# EAGLE design uno-test-shield (EAGLE 7.7.0)
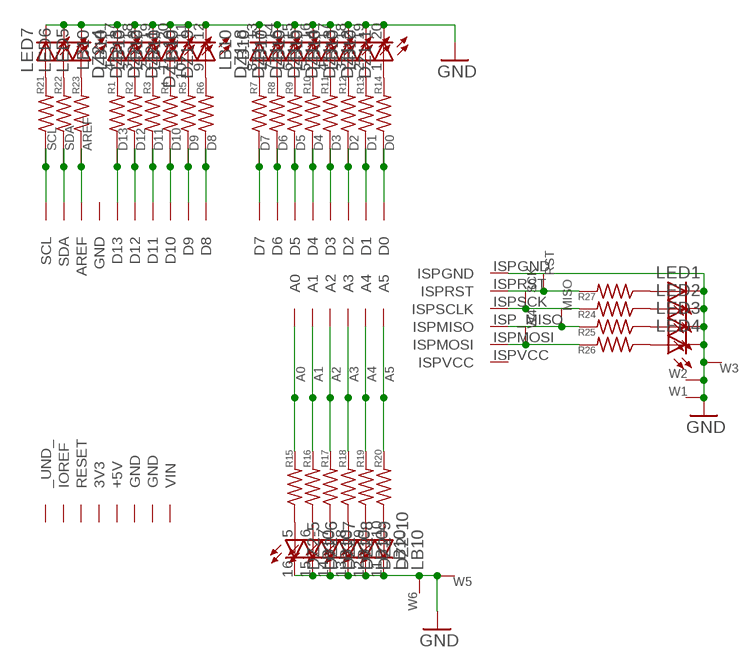
[diagram p0: schematic, sheet 1]

## Parts
A0  WIRE-VIA11  [VIA11]
A1  WIRE-VIA11  [VIA11]
A2  WIRE-VIA11  [VIA11]
A3  WIRE-VIA11  [VIA11]
A4  WIRE-VIA11  [VIA11]
A5  WIRE-VIA11  [VIA11]
AREF  WIRE-VIA11  [VIA11]
D0  WIRE-VIA11  [VIA11]
D1  WIRE-VIA11  [VIA11]
D2  WIRE-VIA11  [VIA11]
D3  WIRE-VIA11  [VIA11]
D4  WIRE-VIA11  [VIA11]
D5  WIRE-VIA11  [VIA11]
D6  WIRE-VIA11  [VIA11]
D7  WIRE-VIA11  [VIA11]
D8  WIRE-VIA11  [VIA11]
D9  WIRE-VIA11  [VIA11]
D10  WIRE-VIA11  [VIA11]
D11  WIRE-VIA11  [VIA11]
D12  WIRE-VIA11  [VIA11]
D13  WIRE-VIA11  [VIA11]
DZ1  LB10  [LB10]
DZ2  LB10  [LB10]
LED1  LED3MM  [LED3MM]
LED2  LED3MM  [LED3MM]
LED3  LED3MM  [LED3MM]
LED4  LED3MM  [LED3MM]
LED5  LED3MM  [LED3MM]
LED6  LED3MM  [LED3MM]
LED7  LED3MM  [LED3MM]
MISO  WIRE-VIA11  [VIA11]
R1  R-US_R0805  [R0805]
R2  R-US_R0805  [R0805]
R3  R-US_R0805  [R0805]
R4  R-US_R0805  [R0805]
R5  R-US_R0805  [R0805]
R6  R-US_R0805  [R0805]
R7  R-US_R0805  [R0805]
R8  R-US_R0805  [R0805]
R9  R-US_R0805  [R0805]
R10  R-US_R0805  [R0805]
R11  R-US_R0805  [R0805]
R12  R-US_R0805  [R0805]
R13  R-US_R0805  [R0805]
R14  R-US_R0805  [R0805]
R15  R-US_R0805  [R0805]
R16  R-US_R0805  [R0805]
R17  R-US_R0805  [R0805]
R18  R-US_R0805  [R0805]
R19  R-US_R0805  [R0805]
R20  R-US_R0805  [R0805]
R21  R-US_R0805  [R0805]
R22  R-US_R0805  [R0805]
R23  R-US_R0805  [R0805]
R24  R-US_R0805  [R0805]
R25  R-US_R0805  [R0805]
R26  R-US_R0805  [R0805]
R27  R-US_R0805  [R0805]
RST  WIRE-VIA11  [VIA11]
SCK  WIRE-VIA11  [VIA11]
SCL  WIRE-VIA11  [VIA11]
SDA  WIRE-VIA11  [VIA11]
U$1  ARDUINO-R3ALLNOHOLES  [R3+ISP-NOHOLES]
W1  WIRE-VIA11  [VIA11]
W2  WIRE-VIA11  [VIA11]
W3  WIRE-VIA11  [VIA11]
W4  WIRE-VIA11  [VIA11]
W5  WIRE-VIA11  [VIA11]
W6  WIRE-VIA11  [VIA11]

## Nets
AREF: AREF.P$1 R23.1 U$1.DAREF(AREF)
D0: D0.P$1 R14.1 U$1.D0
GND [power]: DZ1.11(-10:C) DZ1.12(-9:C) DZ1.13(-8:C) DZ1.14(-7:C) DZ1.15(-6:C) DZ1.16(-5:C) DZ1.17(-4:C) DZ1.18(-3:C) DZ1.19(-2:C) DZ1.20(-1:C) DZ2.11(-10:C) DZ2.12(-9:C) DZ2.13(-8:C) DZ2.14(-7:C) DZ2.15(-6:C) DZ2.16(-5:C) DZ2.17(-4:C) DZ2.18(-3:C) DZ2.19(-2:C) DZ2.20(-1:C) LED1.K(C) LED2.K(C) LED3.K(C) LED4.K(C) LED5.K(C) LED6.K(C) LED7.K(C) U$1.ISPGND W1.P$1 W2.P$1 W3.P$1 W5.P$1 W6.P$1
MISO: MISO.P$1 R25.2 U$1.ISP_MISO(ISPMISO)
MOSI: R26.2 U$1.ISPMOSI W4.P$1
N$1: D13.P$1 R1.1 U$1.D13
N$2: DZ2.4(-4:A) R1.2
N$3: D12.P$1 R2.1 U$1.D12
N$4: DZ2.3(-3:A) R2.2
N$5: D11.P$1 R3.1 U$1.D11
N$6: DZ2.2(-2:A) R3.2
N$7: D10.P$1 R4.1 U$1.D10
N$8: DZ2.1(-1:A) R4.2
N$9: D9.P$1 R5.1 U$1.D9
N$10: DZ1.10(-10:A) R5.2
N$11: D8.P$1 R6.1 U$1.D8
N$12: DZ1.9(-9:A) R6.2
N$13: D7.P$1 R7.1 U$1.D7
N$14: DZ1.8(-8:A) R7.2
N$15: D6.P$1 R8.1 U$1.D6
N$16: DZ1.7(-7:A) R8.2
N$17: D5.P$1 R9.1 U$1.D5
N$18: DZ1.6(-6:A) R9.2
N$19: D4.P$1 R10.1 U$1.D4
N$20: DZ1.5(-5:A) R10.2
N$21: D3.P$1 R11.1 U$1.D3
N$22: DZ1.4(-4:A) R11.2
N$23: D2.P$1 R12.1 U$1.D2
N$24: DZ1.3(-3:A) R12.2
N$25: D1.P$1 R13.1 U$1.D1
N$26: DZ1.2(-2:A) R13.2
N$28: DZ1.1(-1:A) R14.2
N$29: A0.P$1 R15.2 U$1.A0
N$30: DZ2.5(-5:A) R15.1
N$31: A1.P$1 R16.2 U$1.A1
N$32: DZ2.6(-6:A) R16.1
N$33: A2.P$1 R17.2 U$1.A2
N$34: DZ2.7(-7:A) R17.1
N$35: A3.P$1 R18.2 U$1.A3
N$36: DZ2.8(-8:A) R18.1
N$37: A4.P$1 R19.2 U$1.A4
N$38: DZ2.9(-9:A) R19.1
N$39: A5.P$1 R20.2 U$1.A5
N$40: DZ2.10(-10:A) R20.1
N$48: LED1.A R27.1
N$49: LED2.A R24.1
N$50: LED3.A R25.1
N$51: LED4.A R26.1
N$52: LED5.A R23.2
N$53: LED6.A R22.2
N$54: LED7.A R21.2
RST: R27.2 RST.P$1 U$1.ISPRST
SCK: R24.2 SCK.P$1 U$1.ISPSCK(ISPSCLK)
SCL: R21.1 SCL.P$1 U$1.DSCL(SCL)
SDA: R22.1 SDA.P$1 U$1.DSDA(SDA)
Unconnected: U$1.PWR_IOREF(IOREF) U$1.PWR_RST(RESET) U$1.PWR_UNUSED(_UND_)

## Power pins joined to a net without a drawn wire
3V3: U$1.PWR+3V(3V3)
+5V: U$1.PWR+5(+5V)
GND: U$1.DGND(GND) U$1.PWRGND1(GND) U$1.PWRGND2(GND)
ISPVCC: U$1.ISPVCC
VIN: U$1.PWRVIN(VIN)

## Library data of the parts
A0 A1-A5 AREF D0 D1-D13 MISO RST SCK SCL SDA W1-W6 = mylib4:WIRE: Pad for a wire offboard
DZ1 DZ2 = led:LB10: LED BLOCK 10-LED bar graph, DIL, Siemens
LED1-LED7 = my-led:LED: LED OSRAM: - CHIPLED LG R971, LG N971, LY N971, LG Q971, LY Q971, LO R971, LY R971 LH N974, LH R974 LS Q976, LO Q976, LY Q976 LO Q996 - Hyper CHIPLED LW Q18S LB Q993, LB Q99A, LB R99A - SideLED LS A670, LO A670, LY A670, LG A670, LP A670 LB A673, LV A673, LT A673, LW A673 LH A674 LY A675 LS A676, LA A676, LO A676, LY A676, LW A676 LS A679, LY A679, LG A679 - Hyper Micro SIDELED® LS Y876, LA Y876, LO Y876, LY Y876 LT Y87S - SmartLED LW L88C, LW L88S LB L89C, LB L89S, LG L890 LS L89K, LO L89K, LY L89K LS L896, LA L896, LO L896, LY L896 - TOPLED LS T670, LO T670, LY T670, LG T670, LP T670 LSG T670, LSP T670, LSY T670, LOP T670, LYG T670 LG T671, LOG T671, LSG T671 LB T673, LV T673, LT T673, LW T673 LH T674 LS T676, LA T676, LO T676, LY T676, LB T676, LH T676, LSB T676, LW T676 LB T67C, LV T67C, LT T67C, LS T67K, LO T67K, LY T67K, LW E67C LS E67B, LA E67B, LO E67B, LY E67B, LB E67C, LV E67C, LT E67C LW T67C LS T679, LY T679, LG T679 LS T770, LO T770, LY T770, LG T770, LP T770 LB T773, LV T773, LT T773, LW T773 LH T774 LS E675, LA E675, LY E675, LS T675 LS T776, LA T776, LO T776, LY T776, LB T776 LHGB T686 LT T68C, LB T68C - Hyper Mini TOPLED® LB M676 - Mini TOPLED Santana® LG M470 LS M47K, LO M47K, LY M47K Source: http://www.osram.convergy.de/
R1-R27 = my-rcl:R-US_: RESISTOR, American symbol
U$1 = Arduino-shield-scaffolds:ARDUINO-R3ALL

## Net classes
0 default: width 0.5 mm
1 power: width 0.8 mm

## Board
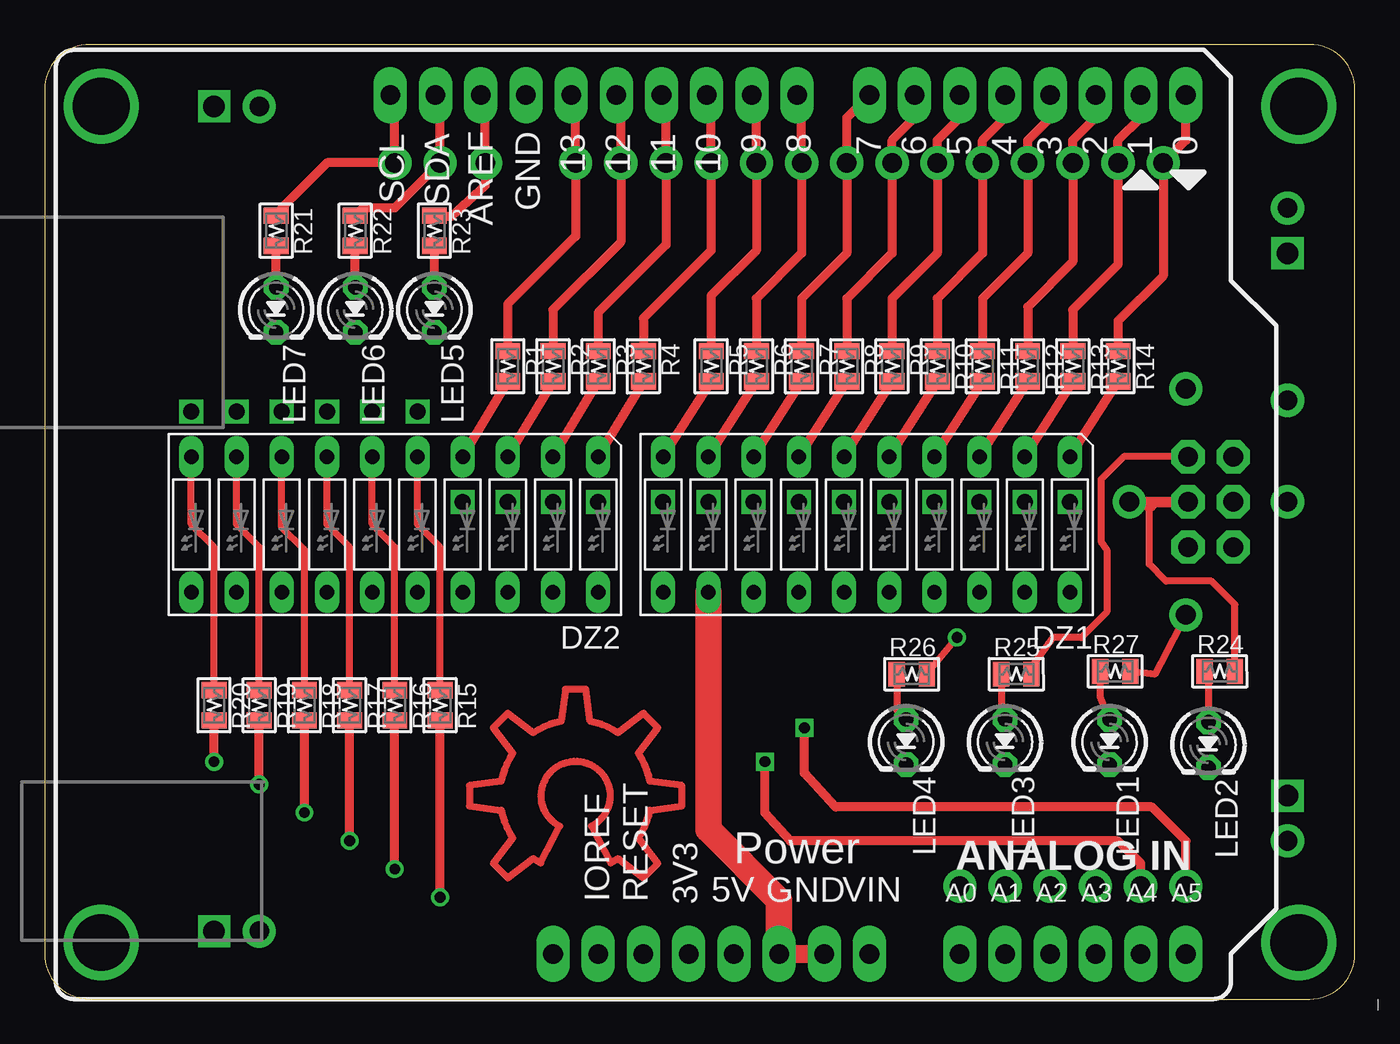
[diagram p1: board, top side]
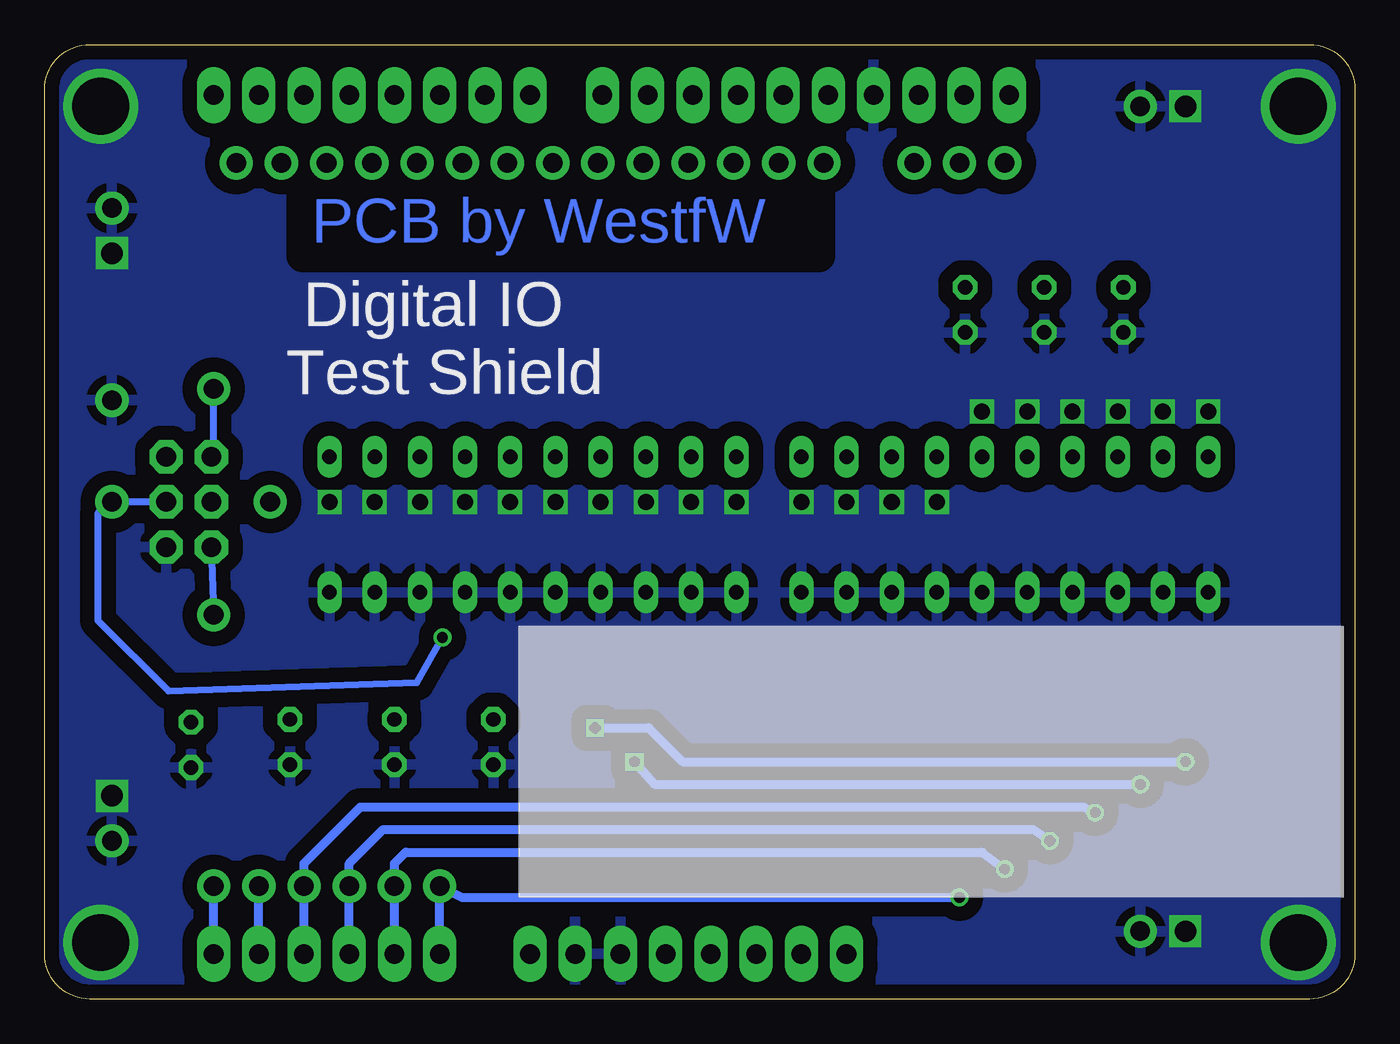
[diagram p2: board, bottom side, seen from below]

Size 73.64 x 53.65 mm. Coordinates in mm from the lower left corner, seen from the top.
Outline: 0,51.1 0,2.54 arc90 2.54,0 71.1,0 arc90 73.64,2.54 73.64,51.1 arc90 71.1,53.65 2.54,53.65 arc90 0,51.1
Copper layers (1*16): Top 0.035mm / dielectric 1.5mm / Bottom 0.035mm
Design rules "default *": minimum track width 10mil, minimum drill 24mil, track to track 8mil, track to pad 8mil, pad to pad 8mil, via to via 8mil, smd to smd 8mil, copper to edge 20mil, drill to drill 8mil, minimum pad ring 10mil, minimum via ring 8mil, stop-mask expansion 4mil, vias tented up to drill 0mil, thermal gap 20mil
bRestrict: 3 lines

### Footprints (pad centres in the part's own frame; a part is rotated, then mirrored left to right if it is on the bottom)
VIA11 = drill 1.1: P$1 0,0
LB10 = drill 0.813 long: 1 -11.43,-3.81; 2 -8.89,-3.81; 3 -6.35,-3.81; 4 -3.81,-3.81; 5 -1.27,-3.81; 6 1.27,-3.81; 7 3.81,-3.81; 8 6.35,-3.81; 9 8.89,-3.81; 10 11.43,-3.81; 11 11.43,3.81; 12 8.89,3.81; 13 6.35,3.81; 14 3.81,3.81; 15 1.27,3.81; 16 -1.27,3.81; 17 -3.81,3.81; 18 -6.35,3.81; 19 -8.89,3.81; 20 -11.43,3.81
LED3MM = drill 0.813 octagon: A -1.27,0; K 1.27,0
R0805 = smd 0.914 x 1.397: 1 -0.85,0; 2 0.85,0
R3+ISP-NOHOLES = drill 1.1 long: A0 50.8,2.54; A1 53.34,2.54; A2 55.88,2.54; A3 58.42,2.54; A4 60.96,2.54; A5 63.5,2.54; D0 63.5,50.8; D1 60.96,50.8; D2 58.42,50.8; D3 55.88,50.8; D4 53.34,50.8; D5 50.8,50.8; D6 48.26,50.8; D7 45.72,50.8; D8 41.656,50.8; D9 39.116,50.8; D10 36.576,50.8; D11 34.036,50.8; D12 31.496,50.8; D13 28.956,50.8; DAREF 23.876,50.8; DGND 26.416,50.8; DSCL 18.796,50.8; DSDA 21.336,50.8; PWR+3V 35.56,2.54; PWR+5 38.1,2.54; PWR_IOREF 30.48,2.54; PWR_RST 33.02,2.54; PWR_UNUSED 27.94,2.54; PWRGND1 40.64,2.54; PWRGND2 43.18,2.54; PWRVIN 45.72,2.54 | drill 1.1 octagon: ISP_MISO 63.627,30.48; ISPGND 66.167,25.4; ISPMOSI 66.167,27.94; ISPRST 63.627,25.4; ISPSCK 63.627,27.94; ISPVCC 66.167,30.48

### Placement (x,y rotation side)
A0  51.43,6.35 0 top
A1  53.98,6.35 0 top
A2  56.52,6.35 0 top
A3  59.05,6.35 0 top
A4  61.59,6.35 0 top
A5  64.14,6.35 0 top
AREF  24.77,46.99 0 top
D0  62.86,46.99 0 top
D1  60.32,46.99 0 top
D2  57.78,46.99 0 top
D3  55.24,46.99 0 top
D4  52.7,46.99 0 top
D5  50.16,46.99 0 top
D6  47.62,46.99 0 top
D7  45.09,46.99 0 top
D8  42.55,46.99 0 top
D9  40,46.99 0 top
D10  37.46,46.99 0 top
D11  34.92,46.99 0 top
D12  32.38,46.99 0 top
D13  29.84,46.99 0 top
DZ1  46.2,26.67 180 top
DZ2  19.69,26.67 180 top
LED1  59.85,14.45 270 top
LED2  65.41,14.29 270 top
LED3  53.98,14.45 270 top
LED4  48.42,14.45 270 top
LED5  21.91,38.73 270 top
LED6  17.46,38.73 270 top
LED7  13.02,38.73 270 top
MISO  64.14,34.29 0 top
R1  26.03,35.56 270 top
R2  28.58,35.56 270 top
R3  31.12,35.56 270 top
R4  33.66,35.56 270 top
R5  37.46,35.56 270 top
R6  40,35.56 270 top
R7  42.55,35.56 270 top
R8  45.09,35.56 270 top
R9  47.62,35.56 270 top
R10  50.16,35.56 270 top
R11  52.7,35.56 270 top
R12  55.24,35.56 270 top
R13  57.78,35.56 270 top
R14  60.32,35.56 270 top
R15  22.23,16.51 270 top
R16  19.69,16.51 270 top
R17  17.14,16.51 270 top
R18  14.61,16.51 270 top
R19  12.07,16.51 270 top
R20  9.53,16.51 270 top
R21  13.02,43.18 270 top
R22  17.46,43.18 270 top
R23  21.91,43.18 270 top
R24  66.04,18.41 0 top
R25  54.61,18.26 0 top
R26  48.74,18.26 0 top
R27  60.17,18.41 0 top
RST  64.14,21.59 0 top
SCK  60.96,27.94 0 top
SCL  19.69,46.99 0 top
SDA  22.23,46.99 0 top
U$1  0.63,0 0 top
W1  12.07,3.81 0 top
W2  12.07,50.16 0 top
W3  69.85,44.45 0 top
W4  69.85,27.94 0 top
W5  69.85,33.66 0 top
W6  69.85,8.89 0 top

### Tracks (layer width: path | path; a pad name or v marks a point on that pad's centre or on a via)
AREF
  Top 0.5: R23.1 21.69,43.97 22.86,43.97 24.77,45.72 AREF.P$1 24.77,50.8 U$1.DAREF
D0
  Top 0.5: R14.1 60.32,38.1 62.86,40.64 D0.P$1 64.14,48.26 U$1.D0
GND  (via drill 0.9, 1.2, 3.2)
  Top 1: U$1.PWRGND1 U$1.PWRGND2
  Top 1.5: DZ1.12 37.31,9.53 41.27,5.56 U$1.PWRGND1
  other vias: 9.53,50.16 9.53,3.81 69.85,41.91 69.85,11.43 8.25,33.02 10.79,33.02 13.34,33.02 15.88,33.02 18.41,33.02 20.95,33.02 23.49,27.94 26.03,27.94 28.58,27.94 31.12,27.94 34.77,27.94 37.31,27.94 39.85,27.94 42.39,27.94 44.93,27.94 47.47,27.94 50.01,27.94 52.55,27.94 55.09,27.94 57.63,27.94 3.17,50.16 3.17,3.17 70.48,50.16 70.48,3.17
  pour Bottom (isolate 0.813): -1.27,56.04 77.47,55.88 77.47,-1.27 -1.27,-1.11
MISO
  Top 0.4: U$1.ISP_MISO 60.64,30.48 59.37,29.21 59.37,25.72 59.69,25.24 59.69,21.75 58.26,20.32 56.67,20.32 55.46,18.63 R25.2
  Bottom 0.4: U$1.ISP_MISO 64.14,30.61 MISO.P$1
MOSI  (via drill 0.6)
  Top 0.4: v51.28,20.32 49.59,18.31 R26.2
  Bottom 0.4: U$1.ISPMOSI W4.P$1 70.01,27.94 70.64,27.3 70.64,21.27 66.67,17.3 52.7,17.78 v51.28,20.32
N$1
  Top 0.5: R1.1 26.03,39.05 29.84,42.86 D13.P$1 29.84,50.55 U$1.D13
N$2
  Top 0.5: R1.2 DZ2.4
N$3
  Top 0.5: R2.1 28.58,38.73 32.38,42.55 D12.P$1 32.38,50.55 U$1.D12
N$4
  Top 0.5: R2.2 DZ2.3
N$5
  Top 0.5: R3.1 31.12,38.58 34.92,42.39 D11.P$1 34.92,50.55 U$1.D11
N$6
  Top 0.5: DZ2.2 R3.2
N$7
  Top 0.5: R4.1 33.66,38.26 37.46,42.07 D10.P$1 37.46,50.55 U$1.D10
N$8
  Top 0.5: R4.2 DZ2.1
N$9
  Top 0.5: R5.1 37.46,39.53 40,42.07 D9.P$1 40,50.55 U$1.D9
N$10
  Top 0.5: DZ1.10 R5.2
N$11
  Top 0.5: R6.1 40,39.37 42.55,41.91 D8.P$1 42.55,50.55 U$1.D8
N$12
  Top 0.5: DZ1.9 R6.2
N$13
  Top 0.5: R7.1 42.55,39.37 45.09,41.91 D7.P$1 45.09,49.53 U$1.D7
N$14
  Top 0.5: DZ1.8 R7.2
N$15
  Top 0.5: R8.1 45.09,39.37 47.62,41.91 D6.P$1 47.62,48.26 48.89,49.53 U$1.D6
N$16
  Top 0.5: DZ1.7 R8.2
N$17
  Top 0.5: R9.1 47.62,39.37 50.16,41.91 D5.P$1 50.16,48.26 51.43,49.53 U$1.D5
N$18
  Top 0.5: DZ1.6 R9.2
N$19
  Top 0.5: R10.1 50.16,39.37 52.7,41.91 D4.P$1 52.7,48.26 53.98,49.53 U$1.D4
N$20
  Top 0.5: DZ1.5 R10.2
N$21
  Top 0.5: R11.1 52.7,39.37 55.24,41.91 D3.P$1 55.24,48.26 56.52,49.53 U$1.D3
N$22
  Top 0.5: DZ1.4 R11.2
N$23
  Top 0.5: R12.1 55.24,38.89 57.78,41.43 D2.P$1 57.78,48.26 59.05,49.53 U$1.D2
N$24
  Top 0.5: DZ1.3 R12.2
N$25
  Top 0.5: R13.1 57.78,38.73 60.32,41.27 D1.P$1 60.32,48.26 61.59,49.53 U$1.D1
N$26
  Top 0.5: DZ1.2 R13.2
N$27
  Top 0.4: 31.81,7.65 arc7 32.23,7.9 33.66,6.8 34.48,7.61 33.38,9.05 arc23 34.02,10.62 35.82,10.86 35.82,12.01 34.02,12.24 arc23 33.38,13.81 34.48,15.25 33.66,16.06 32.23,14.96 arc23 30.66,15.61 30.42,17.4 29.27,17.4 29.03,15.61 arc23 27.46,14.96 26.03,16.06 25.22,15.25 26.31,13.81 arc23 25.66,12.24 23.87,12.01 23.87,10.86 25.66,10.62 arc23 26.31,9.05 25.22,7.61 26.03,6.8 27.46,7.9 arc7 27.88,7.65 28.95,9.71 arc-63 27.91,11.43 arc-243 30.74,9.71 31.81,7.65
N$28
  Top 0.5: DZ1.1 R14.2
N$29  (via drill 0.6)
  Top 0.5: v22.23,5.71 R15.2
  Bottom 0.5: v22.23,5.71 50.16,5.71 A0.P$1 U$1.A0
N$30
  Top 0.4: R15.1 22.23,25.4 20.95,26.67 DZ2.5
N$31  (via drill 0.6)
  Top 0.5: v19.69,7.3 R16.2
  Bottom 0.5: v19.69,7.3 20.95,8.26 53.34,8.26 53.98,7.62 A1.P$1 U$1.A1
N$32
  Top 0.4: R16.1 19.69,25.4 18.41,26.67 DZ2.6
N$33  (via drill 0.6)
  Top 0.5: v17.14,8.89 R17.2
  Bottom 0.5: v17.14,8.89 18.1,9.53 54.61,9.53 56.52,7.62 A2.P$1 U$1.A2
N$34
  Top 0.4: R17.1 17.14,25.4 15.88,26.67 DZ2.7
N$35  (via drill 0.6)
  Top 0.5: v14.61,10.48 R18.2
  Bottom 0.5: v14.61,10.48 15.24,10.79 55.88,10.79 59.05,7.62 A3.P$1 U$1.A3
N$36
  Top 0.4: R18.1 14.61,25.24 13.34,26.51 DZ2.8
N$37  (via drill 0.6)
  Top 0.5: A4.P$1 61.59,7.62 60.32,8.89 41.91,8.89 40.48,10.48 v40.48,13.34 | v12.07,12.06 R19.2
  Bottom 0.5: v40.48,13.34 39.37,12.06 v12.07,12.06 | U$1.A4 A4.P$1
N$38
  Top 0.4: R19.1 12.07,25.4 10.79,26.67 DZ2.9
N$39  (via drill 0.6)
  Top 0.5: A5.P$1 64.14,8.89 62.23,10.79 44.45,10.79 42.7,12.7 v42.7,15.24 | v9.53,13.34 R20.2
  Bottom 0.5: v42.7,15.24 39.69,15.24 37.78,13.34 v9.53,13.34 | U$1.A5 A5.P$1
N$40
  Top 0.4: R20.1 9.53,25.4 8.25,26.67 DZ2.10
N$48
  Top 0.4: R27.1 59.32,17.04 LED1.A
N$49
  Top 0.4: R24.1 65.41,18.2 LED2.A
N$50
  Top 0.4: R25.1 53.76,15.93 LED3.A
N$51
  Top 0.4: R26.1 47.89,16.25 LED4.A
N$52
  Top 0.5: LED5.A R23.2
N$53
  Top 0.5: LED6.A R22.2
N$54
  Top 0.5: LED7.A R21.2
RST
  Top 0.4: RST.P$1 62.39,18.26 R27.2
  Bottom 0.4: U$1.ISPRST RST.P$1
SCK
  Top 0.4: R24.2 66.89,22.17 65.56,23.5 63.02,23.5 62.07,24.45 62.07,27.62 62.23,27.62 62.55,27.94
  Top 0.6: SCK.P$1 61.75,27.94 | 61.75,27.94 62.55,27.94 U$1.ISPSCK | 62.07,27.62 61.75,27.94
SCL
  Top 0.5: R21.1 13.34,44.35 13.34,44.45 15.88,46.99 SCL.P$1 19.69,50.55 U$1.DSCL
SDA
  Top 0.5: R22.1 17.88,44.45 19.69,44.45 SDA.P$1 22.23,50.55 U$1.DSDA

### Text on the board
Bottom: PCB by WestfW
_tSilk: GND | SCL | AREF | 13 | 12 | 11 | 10 | 9 | 8 | 7 | 6 | 5 | 4 | 3 | 2 | 1 | 0 | GND | SCL | SDA | AREF | 13 | 12 | 11 | 10 | 9 | 8 | 7 | 6 | 5 | 4 | 3 | 2 | 1 | 0 | 5 | 4 | 3 | 2 | 1 | 0 | MOSI | MISO | RST | SCK | 0 | 1 | 2 | 3 | 4 | 5 | GND | Digital / IO Test | GND
_bplace: Digital IO / Test Shield